# EAGLE design lightmeter_seeed2 (EAGLE 7.1.0)
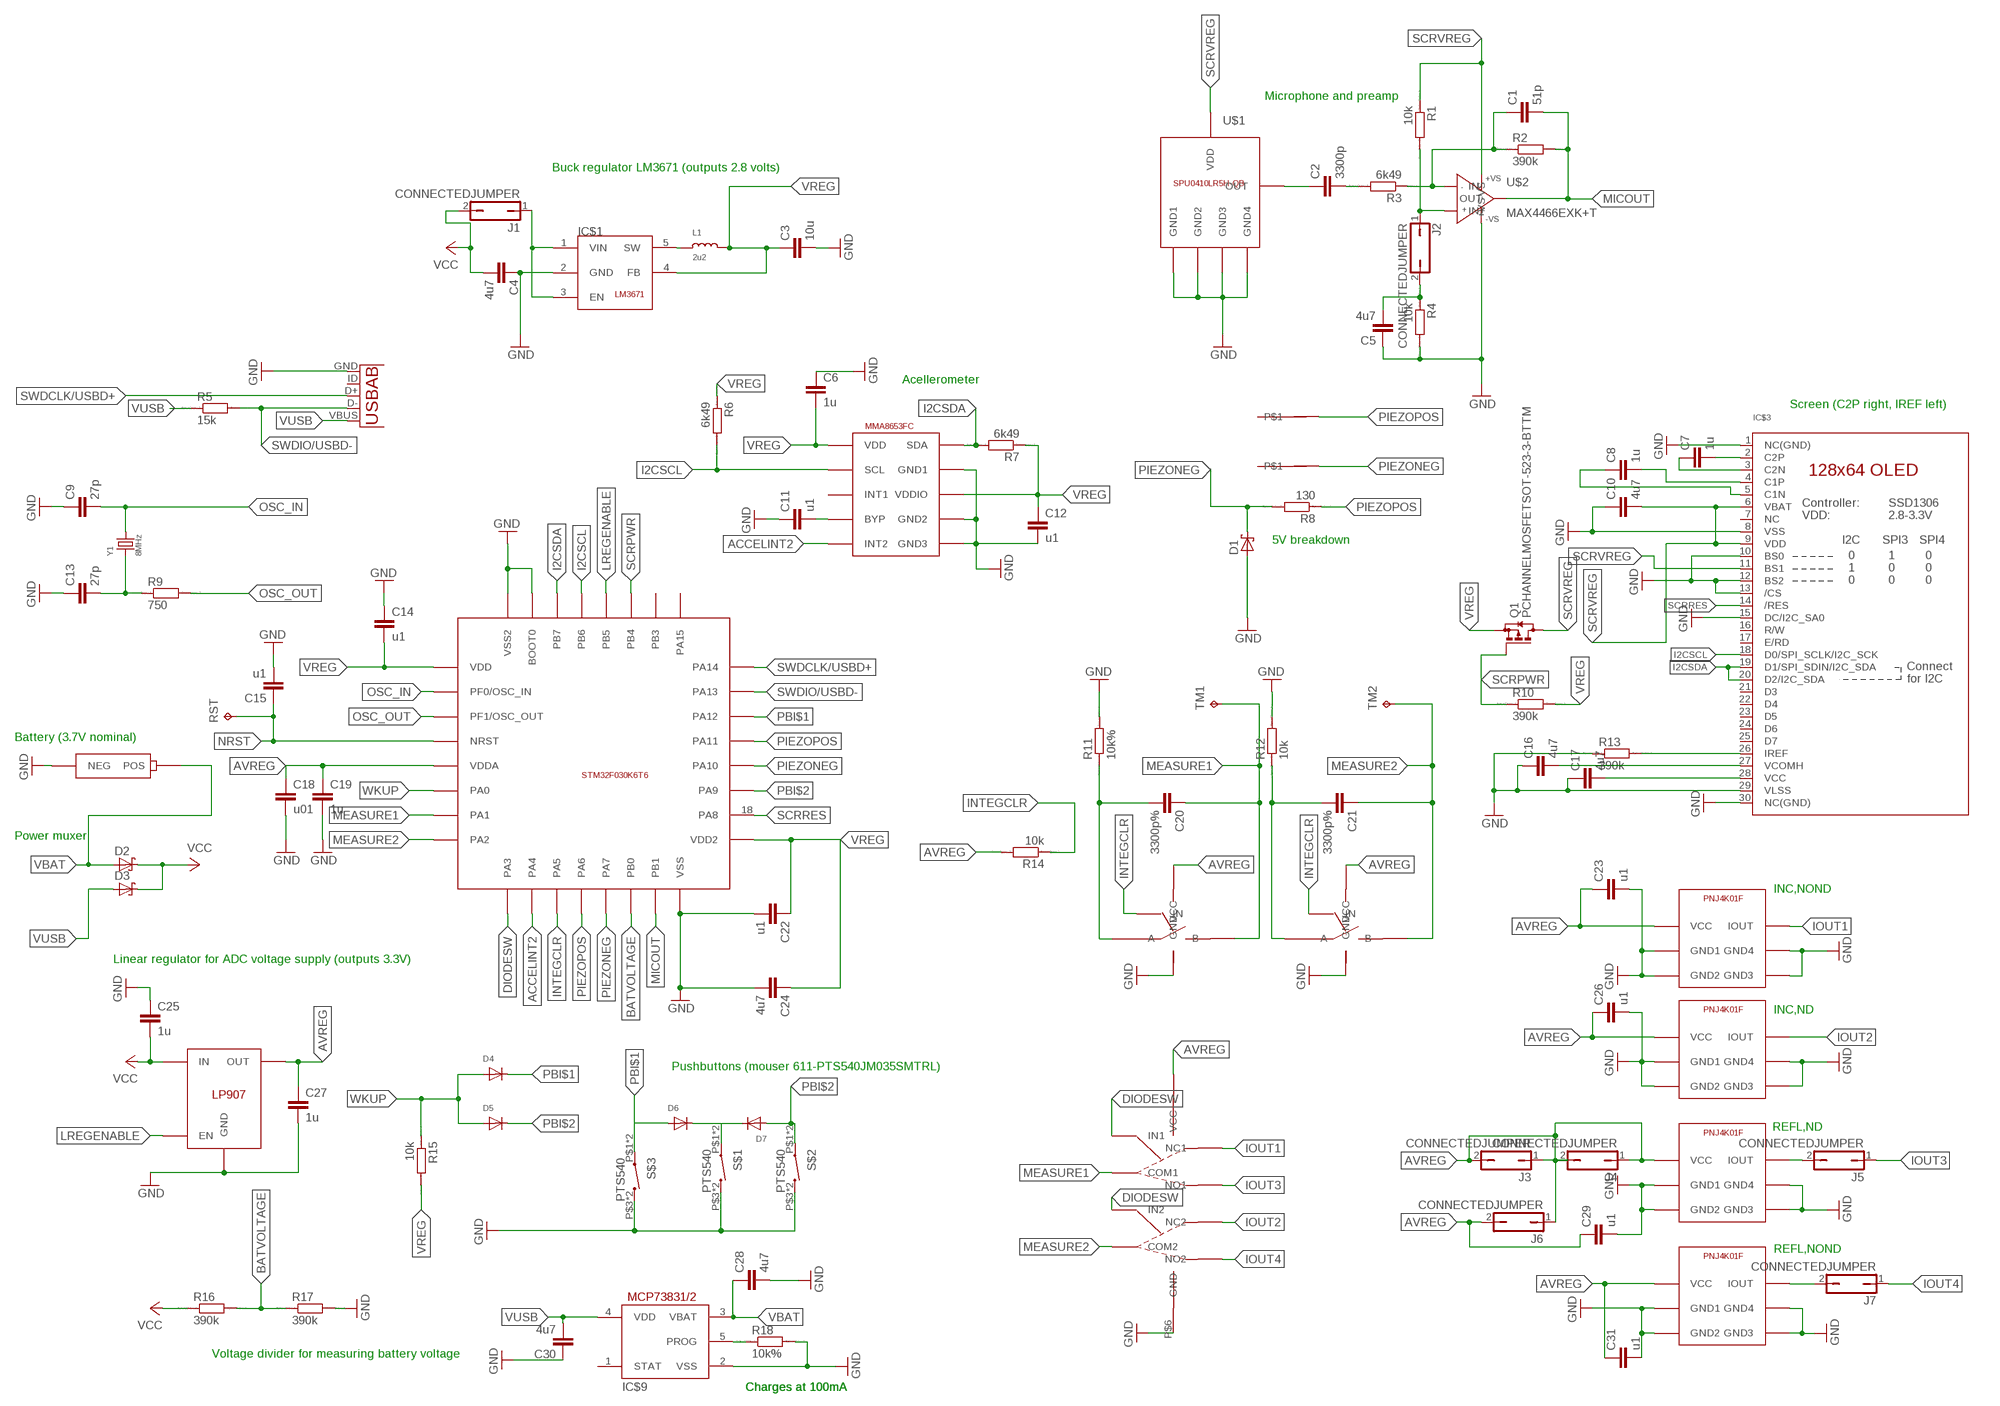
[diagram p0: schematic, sheet 1]

## Parts
C1  51p  C-EUC0402  [C0402]
C2  3300p  C-EUC0603  [C0603]
C3  10u  C-EUC0402  [C0402]
C4  4u7  C-EUC0402  [C0402]
C5  4u7  C-EUC0402  [C0402]
C6  1u  C-EUC0603  [C0603]
C7  1u  C-EUC0603  [C0603]
C8  1u  C-EUC0603  [C0603]
C9  27p  CGAP0402  [GAP0402]
C10  4u7  C-EUC0402  [C0402]
C11  u1  C-EUC0402  [C0402]
C12  u1  C-EUC0402  [C0402]
C13  27p  C-EUC0402  [C0402]
C14  u1  C-EUC0402  [C0402]
C15  u1  C-EUC0402  [C0402]
C16  4u7  C-EUC0402  [C0402]
C17  4u7  C-EUC0402  [C0402]
C18  u01  CGAP0402  [GAP0402]
C19  1u  C  [GAP0603]
C20  3300p%  C-EUC0603  [C0603]
C21  3300p%  C-EUC0603  [C0603]
C22  u1  C-EUC0402  [C0402]
C23  u1  C-EUC0402  [C0402]
C24  4u7  C-EUC0402  [C0402]
C25  1u  C-EUC0603  [C0603]
C26  u1  C-EUC0402  [C0402]
C27  1u  C-EUC0603  [C0603]
C28  4u7  C-EUC0402  [C0402]
C29  u1  C-EUC0402  [C0402]
C30  4u7  C-EUC0402  [C0402]
C31  u1  C-EUC0402  [C0402]
D1  SCHOTTKY-DIODESOD-923-BTTM  [SOD-923-BTTM]
D2  SCHOTTKY-DIODESC-79  [SC-79]
D3  SCHOTTKY-DIODESC-79  [SC-79]
D4  DIODESOD-323F  [SOD-323F]
D5  DIODESOD-323F  [SOD-323F]
D6  DIODESOD-323F  [SOD-323F]
D7  DIODESOD-323F  [SOD-323F]
IC$1  LM3671  [SOT23-5]
IC$2  MMA8653  [DFN-10]
IC$3  DISP_OLED_UG-2864HSWEG010.96"  [UG-2864HSWEG01_0.96IN_WRAPAROUND]
IC$4  STM32F030K6T6  [QFP-32]
IC$5  PNJ4K01F  [PNJ4K01F]
IC$6  LP5907  [SOT23-5L]
IC$7  PNJ4K01F  [PNJ4K01F]
IC$8  PNJ4K01F  [PNJ4K01F]
IC$9  MCP73831/OT  [SOT23-5L]
IC$10  PNJ4K01F  [PNJ4K01F]
J1  CONNECTEDJUMPER  [JUMPER_R0402]
J2  CONNECTEDJUMPER  [JUMPER_R0402]
J3  CONNECTEDJUMPER  [JUMPER_R0402]
J4  CONNECTEDJUMPER  [JUMPER_R0402]
J5  CONNECTEDJUMPER  [JUMPER_R0402]
J6  CONNECTEDJUMPER  [JUMPER_R0402]
J7  CONNECTEDJUMPER  [JUMPER_R0402]
L1  2u2  INDUCTOR_0603  [_0603]
Q1  PCHANNELMOSFETSOT-523-3-BTTM  [SOT-523-3-BTTM]
R1  10k  R-EU_R0402  [R0402]
R2  390k  R-EU_R0402  [R0402]
R3  6k49  R-EU_R0402  [R0402]
R4  10k  R-EU_R0402  [R0402]
R5  15k  R-EU_R0402  [R0402]
R6  6k49  R-EU_R0402  [R0402]
R7  6k49  R-EU_R0402  [R0402]
R8  130  R-EU_R0402  [R0402]
R9  750  R-EU_R0402  [R0402]
R10  390k  R-EU_R0402  [R0402]
R11  10k%  R-EU_R0402  [R0402]
R12  10k  R-EU_R0402  [R0402]
R13  390k  R-EU_R0402  [R0402]
R14  10k  R-EU_R0402  [R0402]
R15  10k  R-EU_R0402  [R0402]
R16  390k  RGAP  [JUMPER_R0402]
R17  390k  R-EU_R0402  [R0402]
R18  10k%  R-EU_R0402  [R0402]
RST  TPB1,27  [B1,27]
S$1  PTS540  [PTS540BTM]
S$2  PTS540  [PTS540BTM]
S$3  PTS540  [PTS540BTM]
TM1  TPB1,27  [B1,27]
TM2  TPB1,27  [B1,27]
U1  USB-ABUSB-AB-MICRO-MIDMOUNT  [USB-AB-MICRO-MIDMOUNT]
U$1  SPU0410LR5H-QBSPU0410LRSH-QB  [SPU0410LR5H-QB]
U$2  MAX4466EXK+T  [SC-70-5]
U$3  LIBAT  [78171-0002]
U$4  SN74LVC1G66  [SOT-553-5]
U$5  SN74LVC1G66  [SOT-553-5]
U$6  NLAS5223B  [WQFN10]
Y1  8MHz  CRYSTAL  [CRYSTAL3.2X5MM]
ZN  WIREATTACHMENT  [SMALLSQUAREWIREHOLE]
ZP  WIREATTACHMENT  [SMALLSQUAREWIREHOLE]

## Nets
ACCELINT2: IC$2.P$5(INT2) IC$4.10(PA4)
AVREG: C18.1 C19.1 C23.1 C26.1 C27.1 C29.1 C31.1 IC$4.5(VDDA) IC$5.P$1(VCC) IC$6.5(OUT) IC$7.P$1(VCC) IC$8.P$1(VCC) IC$10.P$1(VCC) J3.1 J3.2 J4.1 J4.2 J6.1 J6.2 R14.2 U$4.P$5(VCC) U$5.P$5(VCC) U$6.P$1(VCC)
BATVOLTAGE: IC$4.14(PB0) R16.2 R17.1
DIODESW: IC$4.9(PA3) U$6.P$4(IN1) U$6.P$8(IN2)
GND: C3.2 C4.1 C5.1 C6.1 C9.1 C10.1 C11.1 C12.2 C13.1 C14.1 C15.2 C16.1 C17.1 C18.2 C19.2 C22.2 C23.2 C24.2 C25.1 C26.2 C27.2 C28.2 C29.2 C30.1 C31.2 D1.P$1(A) IC$1.2(GND) IC$2.P$6(GND3) IC$2.P$7(GND2) IC$2.P$9(GND1) IC$3.1(NC(GND)) IC$3.8(VSS) IC$3.10(BS0) IC$3.12(BS2) IC$3.13(/CS) IC$3.15(DC/I2C_SA0) IC$3.29(VLSS) IC$3.30(NC(GND)) IC$4.16(VSS) IC$4.31(BOOT0) IC$4.32(VSS2) IC$5.P$2(GND1) IC$5.P$3(GND2) IC$5.P$4(GND3) IC$5.P$5(GND4) IC$6.2(GND) IC$7.P$2(GND1) IC$7.P$3(GND2) IC$7.P$4(GND3) IC$7.P$5(GND4) IC$8.P$2(GND1) IC$8.P$3(GND2) IC$8.P$4(GND3) IC$8.P$5(GND4) IC$9.2(VSS) IC$10.P$2(GND1) IC$10.P$3(GND2) IC$10.P$4(GND3) IC$10.P$5(GND4) R4.2 R11.2 R12.2 R13.1 R17.2 R18.2 S$1.P$3 S$1.P$4 S$2.P$3 S$2.P$4 S$3.P$3 S$3.P$4 U1.GND U$1.P$2(GND1) U$1.P$3(GND2) U$1.P$5(GND3) U$1.P$6(GND4) U$2.P$2(-VS) U$3.P$1(NEG) U$4.P$3(GND) U$5.P$3(GND) U$6.P$6(GND)
I2CSCL: IC$2.P$2(SCL) IC$3.18(D0/SPI_SCLK/I2C_SCK) IC$4.29(PB6) R6.2
I2CSDA: IC$2.P$10(SDA) IC$3.19(D1/SPI_SDIN/I2C_SDA) IC$3.20(D2/I2C_SDA) IC$4.30(PB7) R7.2
INTEGCLR: IC$4.11(PA5) R14.1 U$4.P$4(IN) U$5.P$4(IN)
IOUT1: IC$5.P$6(IOUT) U$6.P$5(NC1)
IOUT2: IC$7.P$6(IOUT) U$6.P$7(NC2)
IOUT3: J5.1 U$6.P$2(NO1)
IOUT4: J7.1 U$6.P$10(NO2)
LREGENABLE: IC$4.28(PB5) IC$6.3(EN)
MEASURE1: C20.1 IC$4.7(PA1) TM1.TP U$4.P$2(B) U$6.P$3(COM1)
MEASURE2: C21.1 IC$4.8(PA2) TM2.TP U$5.P$2(B) U$6.P$9(COM2)
MICOUT: C1.2 IC$4.15(PB1) R2.2 U$2.P$4(OUT)
N$1: IC$8.P$6(IOUT) J5.2
N$2: IC$10.P$6(IOUT) J7.2
N$3: C20.2 R11.1 U$4.P$1(A)
N$4: IC$1.1(VIN) IC$1.3(EN) J1.1
N$5: IC$9.5(PROG) R18.1
N$6: C21.2 R12.1 U$5.P$1(A)
N$7: C11.2 IC$2.P$4(BYP)
N$9: C13.2 R9.1 Y1.P$1
N$10: IC$1.5(SW) L1.1
N$12: C16.2 IC$3.27(VCOMH)
N$13: D6.C D7.C S$1.P$1 S$1.P$2
N$14: C2.1 U$1.P$1(OUT)
N$15: C7.2 IC$3.2(C2P)
N$16: C7.1 IC$3.3(C2N)
N$17: C2.2 R3.2
N$18: C1.1 R2.1 R3.1 U$2.P$3(IN-)
N$19: IC$3.26(IREF) R13.2
N$20: J2.1 R1.2 U$2.P$1(IN+)
N$21: C5.2 J2.2 R4.1
N$24: C8.1 IC$3.5(C1N)
N$27: C8.2 IC$3.4(C1P)
N$30: C17.2 IC$3.28(VCC)
NRST: C15.1 IC$4.4(NRST) RST.TP
OSC_IN: C9.2 IC$4.2(PF0/OSC_IN) Y1.P$2
OSC_OUT: IC$4.3(PF1/OSC_OUT) R9.2
PBI$1: D4.C D6.A IC$4.22(PA12) S$3.P$1 S$3.P$2
PBI$2: D5.C D7.A IC$4.19(PA9) S$2.P$1 S$2.P$2
PIEZONEG: D1.P$2(C) IC$4.13(PA7) IC$4.20(PA10) R8.2 ZN.P$1
PIEZOPOS: IC$4.12(PA6) IC$4.21(PA11) R8.1 ZP.P$1
SCRPWR: IC$4.27(PB4) Q1.P$2(G) R10.1
SCRRES: IC$3.14(/RES) IC$4.18(PA8)
SCRVREG: C10.2 IC$3.6(VBAT) IC$3.9(VDD) IC$3.11(BS1) Q1.P$1(D) R1.1 U$1.P$4(VDD) U$2.P$5(+VS)
SWDCLK/USBD+: IC$4.24(PA14) U1.D+
SWDIO/USBD-: IC$4.23(PA13) R5.2 U1.D-
VBAT: C28.1 D2.P$2(A) IC$9.3(VBAT) U$3.P$2(POS)
VCC: C4.2 C25.2 D2.P$1(C) D3.P$1(C) IC$6.1(IN) J1.2 R16.1
VREG: C3.1 C6.2 C12.1 C14.2 C22.1 C24.1 IC$1.4(FB) IC$2.P$1(VDD) IC$2.P$8(VDDIO) IC$4.1(VDD) IC$4.17(VDD2) L1.2 Q1.P$3(S) R6.1 R7.1 R10.2 R15.2
VUSB: C30.2 D3.P$2(A) IC$9.4(VDD) R5.1 U1.VBUS
WKUP: D4.A D5.A IC$4.6(PA0) R15.1
Unconnected: IC$2.P$3(INT1) IC$3.7(NC) IC$3.16(R/W) IC$3.17(E/RD) IC$3.21(D3) IC$3.22(D4) IC$3.23(D5) IC$3.24(D6) IC$3.25(D7) IC$4.25(PA15) IC$4.26(PB3) IC$9.1(STAT) U1.ID(USBID)

## Notes on the sheet
- Microphone and preamp
- Buck regulator LM3671 (outputs 2.8 volts)
- Acellerometer
- Screen (C2P right, IREF left)
- 5V breakdown
- Battery (3.7V nominal)
- Power muxer
- INC,NOND
- Linear regulator for ADC voltage supply (outputs 3.3V)
- INC,ND
- Pushbuttons (mouser 611-PTS540JM035SMTRL)
- REFL,ND
- REFL,NOND
- Voltage divider for measuring battery voltage
- Charges at 100mA | Charges at 100mA

## Library data of the parts
C1-C8 C10-C17 C20-C31 = rcl:C-EU: CAPACITOR, European symbol
C9 C18 C19 = lightmeter:C: CAPACITOR naming: grid - package width
D1-D3 = lightmeter:SCHOTTKY-DIODE: Schottky Diode
D4-D7 = adafruit:DIODE: Diode SMADIODE - SMA Surface Mount Package 20V 1A Schottky Diode Digikey: 641-1014-6-ND DO-1N4148 - Through Hole Small Current Diode SOD-123 20V 1 A (.5mV Vf) Schottky Diode - Digikey: MBRX120TPMSCT-ND SOD-323 10V 570mA (.38mV Vf, 3ns) Schottky Diode - Digikey: ZLLS410CT-ND SOD-523 30V 30mA Schottky Diode (RB751S-40TE61) - Digikey: RB751S-40TE61CT-ND SOT23-R/W - SOT23 Package (R = Solder Paste/Reflow Ovens, W = Hand-Soldering) BAT54Film 40V 300mA - Digikey: 497-7162-1-ND
IC$1 = lightmeter:LM3671
IC$2 = lightmeter:MMA8653
IC$3 = microbuilder:DISP_OLED_UG-2864HSWEG01: UG-2864HSWEG01 OLED display Both 1.3" and 0.96" models share the same FPC tab footprint, only the screen dimensions vary.
IC$4 = lightmeter:STM32F030K6T6
IC$5 IC$7 IC$8 IC$10 = lightmeter:PNJ4K01F
IC$6 = lightmeter:LP5907
IC$9 = adafruit:MCP73831: MCP73831/2 Miniature Single-Cell, Fully Integrated Li-Ion, Li-Polymer Charge Management Controllers. Nice and small simple lipoly charge controller, with adjustable current and status output (LED) http://www.ladyada.net/library/pcb/eaglelibrary.html
J1-J7 = lightmeter:CONNECTEDJUMPER
L1 = microbuilder:INDUCTOR: Inductors 0603: 10nH Ceramic Inductor - microwire antenna/RF (Digikey: 712-1434-2-ND) 0805: 560nH Ceramic Inductor - RF (Digikey: 553-1047-1-ND) 270nH Ceramic Inductor - Q = 40@250MHz, +-5%, 1 Ohm DC Resistance (Digikey: 535-10506-2-ND) 1007 (2518 Metric) SMT: 10µH 10% 250mOhm 820mA 1007 Inductor (Digikey: 587-2189-1-ND) 22µH 10% 500mOhm 580mA 1007 Inductor (Digikey: 587-2190-1-ND) 47µH 10% 950mOhm 420mA 1007 Inductor (Digikey: 587-2191-1-ND) 47µH 5% 100mOhm 1A 1008 Inductor (Digikey: 732-1816-1-ND) 5.0x5.0mm (Taiyo Yuden NR5040 Series) 6.8µH 20% 2.3A 64mOhm Inductor (Digikey: 587-2374-2-ND) 5.0x5.0mm (TDK VLC5045 Series) 4.7µH 20% 3.3A 34mOhm Inductor (Digikey: 445-6526-1-ND) 6.8µH 20% 2.7A 46mOhm Inductor (Digikey: 445-6527-1-ND) 6.0x6.0mm (TDK VLC6045 Series) 4.7µH 20% 3.8A 27mOhm Inductor (Digikey: 445-6538-2-ND) 6.8µH 20% 3A 41mOhm Inductor (Digikey: 445-6540-1-ND) 6.2µH 30% 2.2A 45mOhm Inductor (Digikey: SRR5028-6R2YCT-ND) - Not TDK VLC6045 but footprint should match 6.0x6.0mm (TDK SLF6045 Series) 6.8uH 30% 2A 33mOhm Inductor (Digikey: 445-4572-1-ND, Mouser: 810-SLF645T6R8N2R0PF)
Q1 = lightmeter:PCHANNELMOSFET
R1-R15 R17 R18 = resistor:R-EU_: RESISTOR, European symbol; SPICEPREFIX: R
R16 = lightmeter:RGAP
RST TM1 TM2 = testpad:TP: Test pad
S$1-S$3 = lightmeter:PTS540
U1 = lightmeter:USB-AB: This is a USB AB connector that is compatible with USB OTG. i.e. this connector can serve as a host or device
U$1 = lightmeter:SPU0410LR5H-QB
U$2 = lightmeter:MAX4466EXK+T
U$3 = lightmeter:LIBAT
U$4 U$5 = lightmeter:SN74LVC1G66
U$6 = lightmeter:NLAS5223B
Y1 = lightmeter:CRYSTAL
ZN ZP = lightmeter:WIREATTACHMENT

## Board
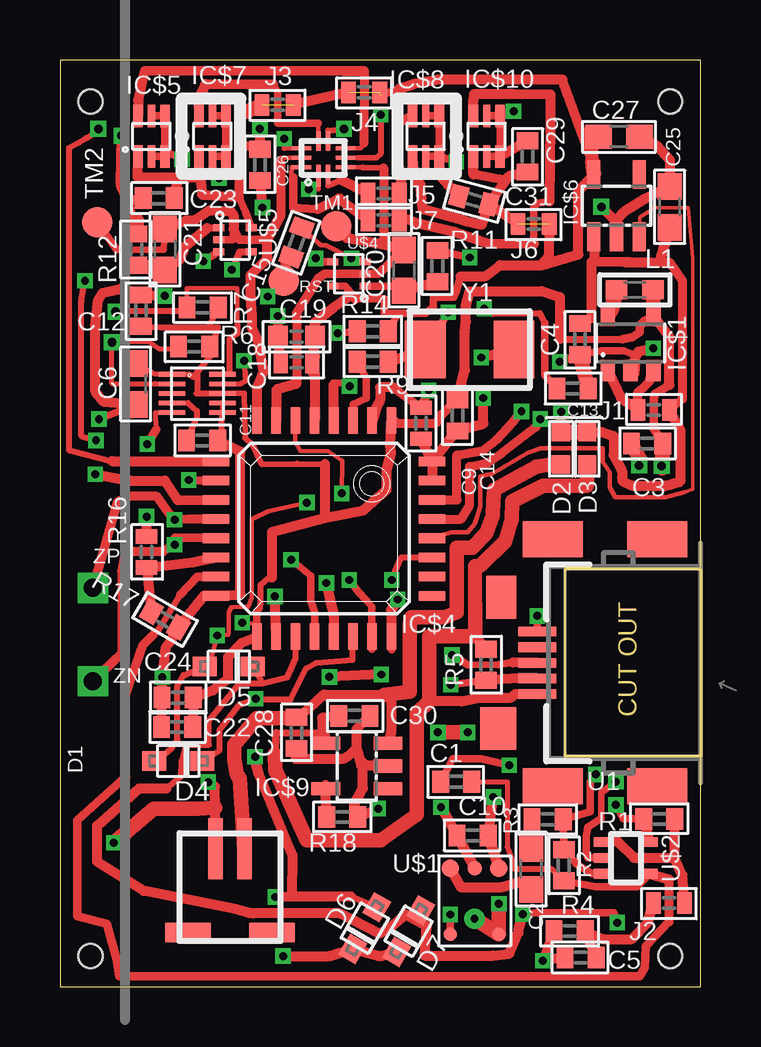
[diagram p1: board, top side]
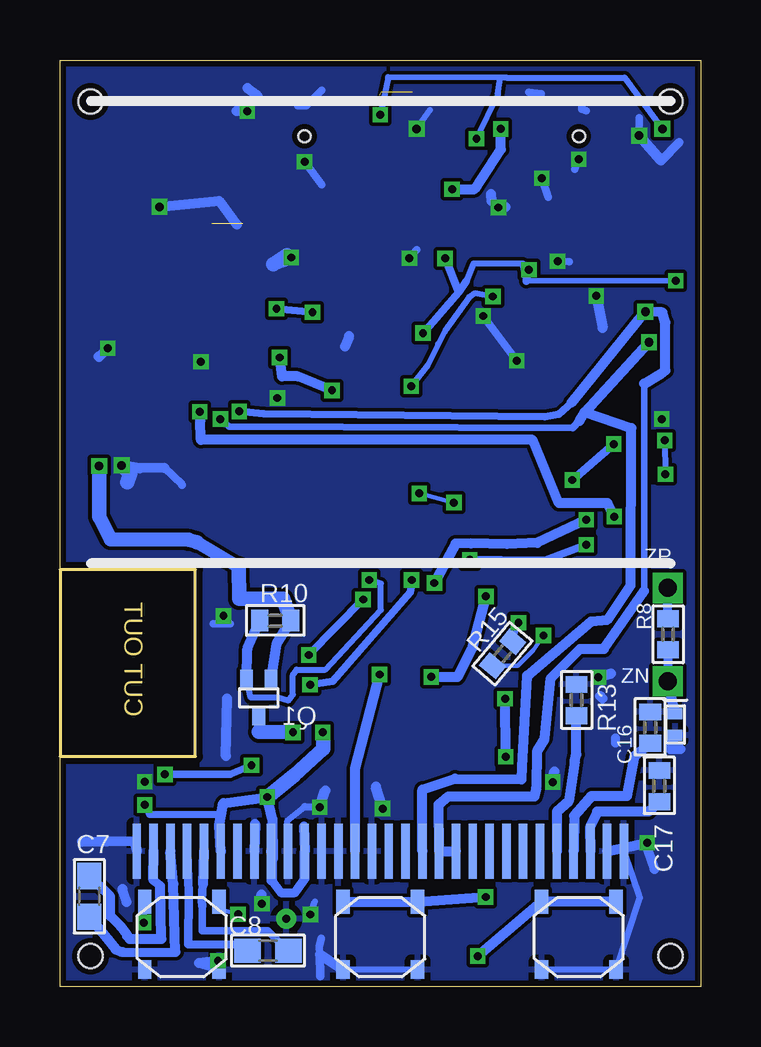
[diagram p2: board, bottom side, seen from below]

Size 26.7 x 38.61 mm. Coordinates in mm from the lower left corner, seen from the top.
Outline: 0,0 26.7,0 26.7,38.61 0,38.61 0,0
Copper layers (1*16): Top 0.035mm / dielectric 1.5mm / Bottom 0.035mm
Design rules "SeeedStudio_2layer_DRU_no_angle_20140221": minimum track width 6mil, minimum drill 12mil, track to track 6mil, track to pad 6mil, pad to pad 6mil, via to via 6mil, smd to smd 0mil, copper to edge 10mil, drill to drill 10mil, minimum pad ring 10mil, minimum via ring 6mil, stop-mask expansion 2mil, vias tented up to drill 100mil, thermal gap 10mil
Holes 1 mm at 25.43,36.88 25.43,1.27 1.27,1.27 1.27,36.88
Holes 0.5 mm at 5.08,35.43 16.51,35.43

### Footprints (pad centres in the part's own frame; a part is rotated, then mirrored left to right if it is on the bottom)
C0402 = smd 0.7 x 0.9: 1 -0.65,0; 2 0.65,0
C0603 = smd 1.1 x 1: 1 -0.85,0; 2 0.85,0
GAP0402 = smd 0.584 x 0.9: 1 -0.65,0; 2 0.65,0
GAP0603 = smd 0.819 x 0.9: 1 -0.767,0; 2 0.767,0
SOD-923-BTTM = smd 0.45 x 0.6 bottom: P$1 -0.45,0; P$2 0.45,0
SC-79 = smd 0.762 x 0.762: P$1 -0.675,0; P$2 0.675,0
SOD-323F = smd 1 x 0.8: A -1,0; C 1,0
SOT23-5 = smd 0.6 x 0.9: 1 -0.95,-1.15; 2 0,-1.15; 3 0.95,-1.15; 4 0.95,1.15; 5 -0.95,1.15
DFN-10 = smd 0.191 x 1.099: P$1 -0.8,-1.048; P$2 -0.4,-1.048; P$3 0,-1.048; P$4 0.4,-1.048; P$5 0.8,-1.048; P$6 0.8,1.048; P$7 0.4,1.048; P$8 0,1.048; P$9 -0.4,1.048; P$10 -0.8,1.048
UG-2864HSWEG01_0.96IN_WRAPAROUND = smd 0.35 x 2.286 bottom: 1 -10.15,-1.2; 2 -9.45,-1.2; 3 -8.75,-1.2; 4 -8.05,-1.2; 5 -7.35,-1.2; 6 -6.65,-1.2; 7 -5.95,-1.2; 8 -5.25,-1.2; 9 -4.55,-1.2; 10 -3.85,-1.2; 11 -3.15,-1.2; 12 -2.45,-1.2; 13 -1.75,-1.2; 14 -1.05,-1.2; 15 -0.35,-1.2; 16 0.35,-1.2; 17 1.05,-1.2; 18 1.75,-1.2; 19 2.45,-1.2; 20 3.15,-1.2; 21 3.85,-1.2; 22 4.55,-1.2; 23 5.25,-1.2; 24 5.95,-1.2; 25 6.65,-1.2; 26 7.35,-1.2; 27 8.05,-1.2; 28 8.75,-1.2; 29 9.45,-1.2; 30 10.15,-1.2
QFP-32 = smd 0.4 x 1.1: 1 -2.4,-4.1; 2 -1.6,-4.1; 3 -0.8,-4.1; 4 0,-4.1; 5 0.8,-4.1; 6 1.6,-4.1; 7 2.4,-4.1; 8 3.2,-4.1; 17 3.2,4.9; 18 2.4,4.9; 19 1.6,4.9; 20 0.8,4.9; 21 0,4.9; 22 -0.8,4.9; 23 -1.6,4.9; 24 -2.4,4.9 | smd 1.1 x 0.4: 9 4.9,-2.4; 10 4.9,-1.6; 11 4.9,-0.8; 12 4.9,0; 13 4.9,0.8; 14 4.9,1.6; 15 4.9,2.4; 16 4.9,3.2; 25 -4.1,3.2; 26 -4.1,2.4; 27 -4.1,1.6; 28 -4.1,0.8; 29 -4.1,0; 30 -4.1,-0.8; 31 -4.1,-1.6; 32 -4.1,-2.4
PNJ4K01F = smd 0.925 x 0.401: P$1 -0.843,0.56; P$3 -0.843,-0.56; P$4 0.843,-0.56; P$6 0.843,0.56 | smd 0.925 x 0.3: P$2 -0.843,0; P$5 0.843,0
SOT23-5L = smd 0.55 x 1.2: 1 -0.95,-1.3; 2 0,-1.3; 3 0.95,-1.3; 4 0.95,1.3; 5 -0.95,1.3
JUMPER_R0402 = smd 0.61 x 0.9: 1 -0.65,0; 2 0.65,0
_0603 = smd 0.9 x 0.8: 1 -0.762,0; 2 0.762,0
SOT-523-3-BTTM = smd 0.533 x 0.762 bottom: P$1 0,0.775; P$2 -0.511,-0.775; P$3 0.511,-0.775
R0402 = smd 0.7 x 0.9: 1 -0.65,0; 2 0.65,0
B1,27 = smd 1.27 x 1.27: TP 0,0
PTS540BTM = smd 0.559 x 1.016 bottom: P$1 -1.55,1.477; P$2 1.55,1.477 | smd 0.559 x 0.762 bottom: P$3 -1.55,-1.35; P$4 1.55,-1.35
USB-AB-MICRO-MIDMOUNT = smd 1.579 x 0.4: D+ 3.378,0; D- 3.378,0.65; GND 3.378,-1.3; ID 3.378,-0.65; VBUS 3.378,1.3 | smd 2.5 x 1.5: P$1 -1.625,-5.15; P$2 -1.625,5.15; P$6 2.725,5.15; P$7 2.725,-5.15 | smd 1.5 x 1.778: P$3 5.01,2.733 | smd 1.246 x 1.778: P$4 4.883,-2.733
SPU0410LR5H-QB = smd 0.723 x 0.723: P$1 -1.015,2.103; P$4 1.015,2.103 | smd 0.562 x 0.562: P$2 -1.015,-0.634; P$3 1.015,-0.634 | smd 0.612 x 0.612: P$5 0,2.103 | drill 0.33: P$6 0,0
SC-70-5 = smd 0.711 x 0.406: P$1 -0.978,0.66; P$2 -0.978,0; P$3 -0.978,-0.66; P$4 0.978,-0.66; P$5 0.978,0.66
78171-0002 = smd 0.6 x 2.54: P$1 -0.6,1.61; P$2 0.6,1.61 | smd 1.905 x 0.8: P$300 -1.75,-1.887; P$400 1.75,-1.887
SOT-553-5 = smd 0.45 x 0.279: P$1 -0.675,0.5; P$2 -0.675,0; P$3 -0.675,-0.5; P$4 0.675,-0.5; P$5 0.675,0.5
WQFN10 = smd 0.917 x 0.178: P$1 -0.747,0.199 | smd 0.815 x 0.178: P$2 -0.696,-0.199; P$6 0.696,-0.199; P$7 0.696,0.199 | smd 0.178 x 0.815: P$3 -0.399,-0.914; P$4 0,-0.914; P$5 0.399,-0.914 | smd 0.178 x 0.805: P$8 0.399,0.914; P$9 0,0.914; P$10 -0.399,0.914
CRYSTAL3.2X5MM = smd 1.7 x 2.4: P$1 -1.85,0; P$2 1.85,0
SMALLSQUAREWIREHOLE = drill 0.75 pad 1.125 square: P$1 0,0

### Placement (x,y rotation side)
C1  16.51,8.53 0 top
C2  19.63,4.9 90 top
C3  24.46,22.63 180 top
C4  21.67,26.97 90 top
C5  21.69,1.21 0 top
C6  3.15,25.11 90 top
C7  25.48,3.76 90 bottom
C8  18.03,1.5 180 bottom
C9  15.04,23.47 90 top
C10  17.2,6.3 0 top
C11  5.92,22.76 180 top
C12  3.38,28.17 90 top
C13  21.36,24.92 180 top
C14  16.56,23.8 90 top
C15  9.86,31.01 70 top
C16  2.11,10.79 270 bottom
C17  1.73,8.36 270 bottom
C18  9.86,26.01 180 top
C19  9.86,27.08 180 top
C20  14.33,29.85 270 top
C21  4.37,30.72 270 top
C22  4.88,10.82 180 top
C23  4.11,32.85 180 top
C24  4.9,12.04 180 top
C25  25.4,32.49 270 top
C26  8.33,34.24 270 top
C27  23.29,35.41 0 top
C28  9.86,10.57 270 top
C29  19.48,34.59 90 top
C30  12.27,11.28 180 top
C31  17.25,32.77 165 top
D1  1.07,10.92 90 top
D2  20.88,22.43 270 top
D3  21.97,22.43 270 top
D4  4.93,9.4 0 top
D5  7.04,13.33 0 top
D6  12.7,2.44 240 top
D7  14.53,2.31 240 top
IC$1  23.77,26.82 0 top
IC$2  5.71,24.71 270 top
IC$3  13.35,4.44 180 top
IC$4  11.4,19.48 180 top
IC$5  3.81,35.43 90 top
IC$6  23.19,32.54 0 top
IC$7  6.35,35.43 90 top
IC$8  15.24,35.43 90 top
IC$9  12.37,9.19 90 top
IC$10  17.78,35.43 90 top
J1  24.74,24.03 0 top
J2  25.37,3.48 180 top
J3  9.07,36.74 180 top
J4  12.67,37.26 180 top
J5  13.49,33.05 0 top
J6  19.74,31.78 180 top
J7  13.49,31.93 0 top
L1  23.95,29.03 0 top
Q1  18.41,12.04 180 top
R1  24.97,6.98 0 top
R2  20.99,5.05 270 top
R3  20.32,6.97 180 top
R4  21.23,2.31 180 top
R5  17.75,13.41 270 top
R6  5.59,26.67 180 top
R7  5.94,28.3 180 top
R8  1.37,14.68 270 bottom
R9  13.03,26.04 180 top
R10  17.73,15.25 0 bottom
R11  15.72,30.02 90 top
R12  3.18,30.71 90 top
R13  5.18,11.94 270 bottom
R14  13.03,27.31 0 top
R15  8.26,13.87 50 bottom
R16  3.61,18.11 270 top
R17  4.37,15.29 330 top
R18  11.76,7.06 0 top
RST  9.32,29.41 0 top
S$1  5.08,2.06 0 top
S$2  21.62,2.06 0 top
S$3  13.35,2.06 0 top
TM1  11.51,31.67 0 top
TM2  1.55,31.85 0 top
U1  23.27,13.49 180 top
U$1  17.27,2.82 0 top
U$2  23.57,5.36 0 top
U$3  7.09,4.14 0 top
U$4  12.04,29.69 180 top
U$5  7.29,31.12 0 top
U$6  10.97,34.53 90 top
Y1  17.07,26.54 0 top
ZN  1.37,12.73 0 top
ZP  1.37,16.61 0 top

### Tracks (layer width: path | path; a pad name or v marks a point on that pad's centre or on a via)
ACCELINT2  (via drill 0.33)
  Top 0.203: 4.01,23.22 3.99,23.93 IC$2.P$5
  Top 0.356: IC$4.10 v5.36,21.11 | v3.63,22.61 4.01,23.22
  Bottom 0.356: v5.36,21.11 v3.63,22.61
AVREG  (via drill 0.33)  (4 unrouted)
  Top 0.178: U$6.P$1 10.77,33.22
  Top 0.203: 10.77,33.22 v10.36,33.22
  Top 0.305: 5.84,33.71 5.92,33 | 13.39,37.13 14.17,37.44 | 14.1,28.05 13.51,28.07 13.51,28.65 12.32,28.65 11.89,29.19 U$4.P$5 | 14.1,28.05 15.24,28.05 15.55,28.33 15.55,28.63 15.57,28.71 16.41,28.71 16.48,28.91 16.69,29.59 | U$5.P$5 7.75,32.26 7.46,32.91 | R14.2 14.1,28.05
  Top 0.381: 7.46,35.1 7.46,35.91 7.6,36.4 | 7.46,35.1 7.46,32.91 | C26.1 7.46,35.1 | 18.52,33.59 17.22,33.84
  Top 0.406: C27.1 22.24,35.21 IC$6.5 21.6,33.15 21.6,30.51 21.03,30.34 20.06,30.06 | 4.93,33.73 3.4,33.73 3.23,33.72 IC$5.P$1 | 4.93,33.73 5.84,33.71 | 14.17,37.44 14.71,37.59 15.77,37.8 20.93,37.8 22.19,34.39 22.1,34.1 | IC$4.5 10.62,24.14 10.62,25.5 10.53,25.59 C18.1 | 10.62,26.26 10.53,26.4 C18.1 | 16.69,29.59 17.73,29.6 18.34,30.06 20.06,30.06 | J4.2 J3.1 | 12.32,28.65 12.12,28.8 11.41,28.3 10.62,27.69 C19.1 C18.1 | 7.46,32.91 5.92,33 5.79,34.16 IC$7.P$1 | C23.1 4.93,33.73 | IC$8.P$1 14.69,34.23 14.91,33.45 15.01,33.43 15.11,32.38 16.87,31.9 17.58,31.75 C31.1 | C29.1 18.7,33.76 | 18.7,33.76 18.52,33.59 | 17.22,33.84 17.22,34.16 IC$10.P$1 | C31.1 J6.2 | C31.1 18.7,33.76 | J6.1 20.37,30.4 20.06,30.06 | v8.33,35.74 C26.1
  Top 0.559: 8.31,36.68 J3.2
  Top 0.61: IC$6.5 22.19,34.39 | 8.31,36.68 7.6,36.4
  Bottom 0.406: v8.33,35.74 C26.1 9.42,33.22 v10.36,33.22
BATVOLTAGE
  Top 0.406: IC$4.14 5.51,17.68 R16.2 R17.1
DIODESW  (via drill 0.33, 0.36)
  Top 0.178: 12.41,34.53 U$6.P$4 | U$6.P$8 9.35,34.93
  Top 0.229: 13.18,34.54 12.41,34.53 | 9.35,34.93 v9.35,35.33
  Top 0.254: 13.18,34.54 13.36,34.7 v13.36,36.32 | v1.6,35.74 1.55,35.64 1.09,35.36 0.76,35.15 0.38,34.95 0.38,22.35 2.16,21.9
  Top 0.406: 2.16,21.9 IC$4.9
  Bottom 0.254: v1.6,35.74 3.18,37.87 8.1,37.87 8.35,37.87 | v9.35,35.33 8.46,37.16 8.35,37.87 | 8.35,37.87 13.03,37.9 v13.36,36.32
GND  (via drill 0.33, 0.36)
  Top 0.178: U$6.P$6 11.18,35.66 | C15.2 10.87,30.9 11.07,30.9 v12.14,30.35
  Top 0.203: IC$2.P$9 7.53,25.11 | IC$2.P$7 IC$2.P$6
  Top 0.229: 7.53,25.11 7.73,25.25 v7.67,26.07
  Top 0.254: C6.1 3,23.8 | C11.1 6.75,23.21 IC$2.P$6 6.75,23.67 | 11.18,35.66 v11.84,35.74
  Top 0.279: 22.55,7.01 22.55,8.08 v23.16,8.53
  Top 0.305: 2.59,35.43 v2.56,35.46 | R11.2 v17.07,30.38 | U$1.P$2 v16.27,3 | C6.1 v1.63,23.65 | U1.GND v19.89,15.44 | IC$5.P$5 IC$5.P$4 IC$5.P$3 | IC$5.P$3 IC$5.P$2 | IC$5.P$3 4.32,34.85 v5.08,34.47 | IC$7.P$2 IC$7.P$3 | v6.63,33.68 6.35,33.86 IC$7.P$2 | IC$8.P$5 IC$8.P$4 IC$8.P$3 | IC$8.P$2 IC$8.P$3 | IC$8.P$3 v16.51,34.37 | IC$10.P$2 IC$10.P$3 IC$10.P$4 IC$10.P$5 | 24,26.29 23.5,26.49 22.58,26.49 C4.1 v20.83,26.04 | U$5.P$3 v5.97,30.23 | U$4.P$3 v12.14,30.35 | IC$7.P$5 IC$7.P$4 IC$7.P$3 IC$7.P$2 | U$2.P$2 22,5.36 21.92,5.61 21.92,6.27 22,6.63 22.55,7.01
  Top 0.356: 24,26.06 23.98,25.55 IC$1.2
  Top 0.406: IC$4.32 IC$4.31 | C27.2 24.84,35.05 25.43,34.42 C25.1 24.98,33.14 24.38,32.82 23.52,32.28 23.22,31.98 23.22,31.26 IC$6.2 23.19,31.85 v22.55,32.49 | 12.55,9.22 12.62,9.35 12.62,8.25 12.26,7.61 R18.2 v13.26,7.42 | 12.55,9.22 13.39,9.22 IC$9.2 | C30.1 12.94,11.32 12.34,10.72 12.34,9.93 | 12.34,9.93 12.55,9.22 | C28.2 9.82,9.48 11.81,9.5 12.04,9.63 12.34,9.93 | IC$4.32 16.28,22.87 C14.1 17.64,23.46 v17.64,24.52 | IC$1.2 24,26.29 24.11,26.47 v24.71,26.59 | v4.36,28.78 C12.2 2.54,29.08 1.78,28.91 1.6,28.63 1.47,27.51 1.47,24.79 1.82,24.37 C6.1 | C22.2 C24.2 v4.27,12.89 4.39,14.1 4.55,14.33 4.92,14.98 R17.2 5.98,16.28 IC$4.16 7.52,16.31 7.52,22.3 C11.1 | v2.56,35.46 2.54,33.45 2.59,33.25 2.79,32.74 | U$3.P$1 6.47,7.45 6.45,8.33 v6.17,8.52 | R12.2 2.79,32.74 | 2.79,32.74 C23.2 | C26.2 v8.43,32.46 | IC$8.P$3 15.8,33.83 C31.2 | v9.07,27.94 C19.2 C18.2 | C29.2 IC$10.P$3 | IC$10.P$4 v18.9,36.47 | R4.2 v20.12,1.08 C5.1 | C10.1 U$1.P$5 16.48,6.4 v15.88,7.47 | IC$4.32 C9.1
  Top 0.61: C3.2 24.17,22 v24.13,21.72 | R12.2 3.2,31.93 | v18.29,3.45 U$1.P$3 U$1.P$6 | v2.23,5.99 3.91,7.42 5.74,7.42 6.47,7.45 | C13.1 C4.1
  Bottom 0.254: v11.84,35.74 11.28,36.52 | S$3.P$3 S$3.P$4 | S$1.P$4 S$1.P$3 2.54,3.68 IC$3.30 | v16.27,3 16.08,3.54 | IC$3.10 17.22,6.91 16.51,7.49
  Bottom 0.305: v7.67,26.07 v9.07,27.94 | 15.8,37.34 16.43,36.7 16.79,36.7 | 4.98,36.93 4.95,36.55 4.78,36.5 | 18.57,5.3 IC$3.8 | v2.56,35.46 2.56,36.2 | 15.88,1.35 15.89,1.66 15.82,2.01 | v15.88,7.47 16.51,7.49 | v1.63,23.65 1.5,23.7 | v19.89,15.44 19.61,15.11 20.32,15.11 | v5.08,34.47 5.26,34.06 | v6.63,33.68 6.35,32.89 | 6.65,37.21 7.16,37.26 | v16.51,34.37 15.8,33.4 | v5.97,30.23 5.49,30.2 | v12.14,30.35 11.84,30.71 | v23.16,8.53 23.27,8.38 | v20.83,26.04 20.75,26.19
  Bottom 0.343: 21.62,20.9 22.35,21.62
  Bottom 0.356: 15.85,0.43 15.88,1.35 | 0.89,35.18 1.65,34.42 | 4.2,12.12 4.15,12.12 | S$2.P$3 20.91,0.98
  Bottom 0.381: 3.56,10.36 3.56,10.16 | D1.P$1 1.27,9.91
  Bottom 0.406: 4.09,12 4.2,12.12 | v22.55,32.49 20.07,32.74 19.33,31.75 | v24.71,26.59 25.07,26.24 25.09,26.26 | S$3.P$4 15.88,1.35 | 18.57,6.78 IC$3.8 | v13.26,7.42 13.54,8.33 | 25.78,6.04 23.6,6.07 IC$3.1 | 19.79,9.6 19.74,12.01 | 1.65,34.42 v2.56,35.46 | 2.34,6.04 1.93,4.9 | 1.27,9.91 0.84,9.91 | v4.36,28.78 4.09,27.43 | v4.27,12.89 3.73,13.06 | 22.35,21.62 23.39,21.59 v24.13,21.72 | 8.71,32.74 8.74,33.02 | v6.17,8.52 6.1,8.97 | 18.47,37.11 18.9,37.44 | v8.43,32.46 8.13,32.49 | IC$3.29 v2.23,5.99 | v18.9,36.47 19.36,36.47 | 23.93,3.53 24.11,4.06 | v20.12,1.08 20.91,0.98 | v15.88,7.47 15.65,8.18 | v18.29,3.45 18.31,3.83 | 14.66,27.1 14.83,26.67
  Bottom 0.61: v24.13,21.72 23.77,21.36 23.9,21.01 | 17.22,30.48 17.67,30.19 | 17.67,30.19 17.8,30.1 | v17.07,30.38 17.67,30.19
  pour Bottom: -0.03,38.89 26.62,39.04 26.42,0.23 -0.23,0.08
I2CSCL  (via drill 0.33, 0.36)
  Top 0.178: 5.01,26.58 arc-90 5.19,26.4
  Top 0.203: IC$2.P$2 3.96,25.12 2.16,25.12 v2.16,26.85 3.61,26.87 3.78,26.82 4.12,26.58 5.01,26.58
  Top 0.229: 5.19,26.4 R6.2
  Top 0.381: IC$4.29 16.71,19.48 17.07,20.07 17.07,21.67 17.83,21.82 18.41,22.23 19.84,23.32 v20.02,23.65
  Bottom 0.292: v20.02,23.65 19.66,23.34 5.33,23.29
  Bottom 0.305: 5.33,23.29 5.05,23.57
  Bottom 0.406: 5.05,23.57 4.84,23.94 | 4.84,23.94 v2.16,26.85 | IC$3.18 11.6,8.21 10.24,8.66 7.47,8.64 7.44,9.17 7.24,12.95 4.57,15.21 3.89,15.29 2.92,16.71 2.9,23.27 4.84,23.94
I2CSDA  (via drill 0.33, 0.36)
  Top 0.178: R7.2 5.28,29.1 7.39,29.1 7.39,27.56
  Top 0.229: 7.06,25.53 IC$2.P$10
  Top 0.254: 7.39,27.56 7.39,27.2 7.06,26.98 7.06,25.53 | 2.36,28.17 5.04,28.17 R7.2
  Top 0.305: v2.31,28.12 2.34,28.17 2.36,28.17
  Top 0.381: IC$4.30 16.54,20.28 16.54,22.15 17.6,22.33 18.21,22.81 18.87,23.52 v19.23,23.96
  Bottom 0.279: 2.36,16.49 2.36,25.12
  Bottom 0.305: v19.23,23.96 18.21,23.88 6.5,23.75 5.92,23.85 5.38,24.33
  Bottom 0.406: 5.38,24.33 v2.31,28.12 1.6,28.09 1.47,27.66 1.47,25.68 1.68,25.53 2.36,25.12 | IC$3.20 IC$3.19 10.93,7.59 10.52,7.92 6.93,7.92 6.86,8.28 6.84,9.8 6.5,10.34 6.25,12.85 5.03,14.07 4.04,14.07 2.36,16.49
INTEGCLR  (via drill 0.33)
  Top 0.254: v1.5,22.76 0.89,22.94 0.89,28.55 v1.04,29.41
  Top 0.305: U$5.P$4 7.49,30.61 v7.16,29.87 | U$4.P$4 11,30.2 v10.66,30.34 | v11.58,27.23 R14.1
  Top 0.406: v1.47,21.35 2.92,21.08 4.37,21.08 4.9,20.27 IC$4.11
  Bottom 0.254: v1.04,29.41 7.26,29.4 7.42,30.12 9.47,30.12 9.78,29.39 | v1.5,22.76 v1.47,21.35
  Bottom 0.305: v11.58,27.23 10.09,28.93 | 10.09,28.93 9.78,29.39 | v7.16,29.87 7.26,29.4 | v10.66,30.34 10.09,28.93
IOUT1
  Top 0.178: U$6.P$5 12.52,34.93
  Top 0.203: 12.52,34.93 12.68,35.15
  Top 0.254: 12.68,36.63 12.65,35.95
  Top 0.381: 12.68,38.15 12.68,36.63 12.68,35.15
  Top 0.394: 3.25,36.93 3.53,38.16 11.2,38.16 11.81,38.15
  Top 0.406: 11.81,38.15 12.68,38.15 | 3.25,36.93 IC$5.P$6
IOUT2
  Top 0.178: 10.77,35.98 10.77,35.69 U$6.P$7
  Top 0.305: 8.89,37.6 9.07,37.26 9.07,35.98 10.77,35.98
  Top 0.394: 8.89,37.6 6.07,37.6
  Top 0.406: 6.07,37.6 5.87,37.21 5.77,36.96 IC$7.P$6
IOUT3
  Top 0.203: 11.18,33.38 U$6.P$2
  Top 0.254: 11.74,33.6 11.18,33.38 | 12.71,33.1 J5.1
  Top 0.406: 12.71,33.1 11.74,33.6
IOUT4
  Top 0.178: 9.72,33.73 9.63,33.83 9.65,34.13 U$6.P$10
  Top 0.356: 9.72,33.73 9.72,32.45 10.72,32.4
  Top 0.406: 10.72,32.4 11.66,32.84 11.61,32.83 J7.1
LREGENABLE
  Top 0.152: 26.01,20.6 26.37,20.73 26.37,30.35 26.19,32.46 24.79,32.46 24.16,32.05 IC$6.3
  Top 0.178: 26.01,20.6 25.25,20.4 23.14,20.4 22.91,20.8 22.91,21.44 22.61,21.87 22.61,22.43 20.04,22.43 19.48,22.25 18.01,21.36 17.5,21.26 17.5,19.99 17.27,19.28 16.99,18.92 16.31,18.92 IC$4.28
MEASURE1
  Top 0.178: U$6.P$3 12.6,34.13
  Top 0.254: 12.6,34.13 13.49,34.11
  Top 0.356: C20.1 13.28,29.69 U$4.P$2 11.02,29.69 10.77,29.52
  Top 0.368: 9.86,28.07 9.86,27.81
  Top 0.381: 13.49,34.11 13.49,31.52 13.48,30.91 | 9.86,27.81 9.86,25.12 | 10.77,29.52 9.86,28.07
  Top 0.406: C20.1 13.48,30.91 11.95,31.19 11.86,31.57 TM1.TP | 9.86,25.12 9.02,24.87 IC$4.7
MEASURE2
  Top 0.178: 9.26,34.53 9.2,34.34 | 9.2,34.53 9.26,34.53 | U$6.P$9 9.26,34.53
  Top 0.279: 2.36,30.71 4.32,30.71 C21.1
  Top 0.305: TM2.TP 2.36,30.71 | 7.24,31.57 7.19,31.12 U$5.P$2
  Top 0.356: 7.24,31.57 7.47,31.12 8.64,31.12
  Top 0.381: 9.2,34.34 9.2,32.14
  Top 0.406: C21.1 5.26,31.92 5.61,31.94 6.22,32.35 7.09,32.31 7.24,32.13 7.24,31.57 | IC$4.8 8.2,24.94 8.48,25.65 8.28,26.82 8,27.46 8,27.94 7.95,28.7 7.95,29.67 8.64,30.33 8.64,31.12 9.2,32.14
MICOUT
  Top 0.203: C1.2 18.64,8.53 18.63,5.82 18.96,4.9
  Top 0.254: 18.96,4.9 20.47,4.9 R2.2
  Top 0.267: 4.04,14.78 4.14,14.91 5,16.33
  Top 0.279: 3.91,14.68 4.04,14.78
  Top 0.305: U$2.P$4 24.05,4.17 22.33,4.17 R2.2
  Top 0.356: 5,16.33 5.71,17.07 IC$4.15 | 25.38,2.69 24.41,1.68 24.36,0.79 24.16,0.43 2.46,0.43 2.36,1.12 1.96,2.62 0.71,2.92 0.71,6.93 2.74,8.74 | 3.45,14.22 3.91,14.68
  Top 0.381: 25.38,4.47 25.38,2.69 | 2.74,8.74 2.74,12.19 3.45,14.22
  Top 0.406: U$2.P$4 25.38,4.47
N$1
  Top 0.406: J5.2 14.25,33.24 14.12,34.11 14.07,34.44 14.07,35.99 IC$8.P$6
N$2
  Top 0.305: 19.75,32.18 19.74,32.46 19.89,32.64 20.4,32.72
  Top 0.318: 19.75,30.95 19.75,32.18
  Top 0.406: 20.4,32.72 20.45,35.92 20.45,37.16 18.87,37.19 17.25,37.19 17.22,36.93 IC$10.P$6 | J7.2 14.53,31.95 14.83,31.8 16.46,31.43 17.8,30.96 19.75,30.95
N$3
  Top 0.335: U$4.P$1 14,29.19
  Top 0.406: 14,29.19 C20.2 14.86,29.16 R11.1
N$4
  Top 0.381: J1.1 24.08,24.77 24.33,24.98 24.56,25.21 IC$1.3
  Top 0.406: IC$1.1 23.39,24.49 J1.1
N$5
  Top 0.406: R18.1 11.06,8.4 10.92,8.25 11.05,8.36 IC$9.5
N$6
  Top 0.305: 6.12,31.6 U$5.P$1
  Top 0.406: C21.2 5,30.3 5.23,30.86 6.12,31.6
  Top 0.61: R12.1 C21.2
N$7
  Top 0.203: 5.33,24.31 IC$2.P$4
  Top 0.254: C11.2 5.71,23.75 5.71,23.98 5.33,24.31
N$9  (via drill 0.33)
  Top 0.279: 20.19,27.66 19.99,28.05 18.01,28.04 17.58,28.23 v17.68,28.25
  Top 0.305: C13.2 20.19,25.48 20.19,27.66 | v16.18,28.09 Y1.P$1
  Top 0.406: R9.1 Y1.P$1
  Bottom 0.305: v17.68,28.25 v16.18,28.09
N$10
  Top 0.61: L1.1 22.96,28.16 IC$1.5
N$12
  Bottom 0.406: IC$3.27 5.28,7.11 4.55,7.95 3.07,7.95 2.74,9.63 C16.2
N$13  (via drill 0.33)
  Top 0.406: v9.3,1.27 11.2,1.27 D6.C 13.34,1.27 D7.C
  Bottom 0.406: S$1.P$1 S$1.P$2 v9.3,1.27
N$14
  Top 0.406: U$1.P$1 16.69,4.14 18.39,4.14 19.23,4.39 C2.1
N$15
  Bottom 0.381: 22.53,4.19 22.81,4.44
  Bottom 0.406: 22.53,4.19 22.48,1.98 23.8,1.98 23.9,2.11 23.93,2.18 24.16,2.49 24.61,2.95 24.61,3.76 C7.2 | 22.81,4.44 IC$3.2
N$16
  Bottom 0.381: 24.11,1.43 21.89,1.43
  Bottom 0.406: C7.1 24.38,1.55 24.11,1.43 | 21.89,1.43 21.97,4.27 IC$3.3
N$17
  Top 0.305: C2.2 R3.2
N$18  (via drill 0.33)
  Top 0.305: U$2.P$3 22.17,4.7 21.54,5.1 R2.1 R3.1 22.1,7.29 22.1,8.53 v22.33,8.84 | v18.72,9.22 17.55,9.5 16.36,9.5 C1.1
  Bottom 0.305: v22.33,8.84 19.61,8.84 v18.72,9.22
N$19
  Bottom 0.406: IC$3.26 5.99,7.29 5.51,7.72 5.26,9.39 5.18,9.68 R13.2
N$20
  Top 0.406: R1.2 25.6,6.1 25.6,5.38 | 25.6,5.38 25.6,5.36 23.93,5.36 23.24,6.04 U$2.P$1 | J2.1 25.93,4.65 25.6,5.38
N$21
  Top 0.406: C5.2 R4.1 22.63,1.98 23.82,1.98 24.49,2.67 J2.2
N$24
  Bottom 0.305: 20.78,3.35 20.78,2.34 18.03,2.34 C8.1
  Bottom 0.356: 20.78,3.35 20.8,3.61 20.75,4.27
  Bottom 0.406: IC$3.5 20.75,4.27
N$27
  Bottom 0.305: C8.2 19.36,1.76
  Bottom 0.343: 21.36,1.77 19.36,1.76
  Bottom 0.356: IC$3.4 21.34,3.86 21.36,1.77
N$30
  Bottom 0.406: IC$3.28 4.62,6.63 4.32,7.29 2.18,7.29 C17.2
NRST  (via drill 0.33)
  Top 0.254: RST.TP v8.66,28.75 | v12.07,25.02 11.66,25.16
  Top 0.279: 11.41,25.07 11.38,25.16
  Top 0.292: 11.38,25.16 11.66,25.16
  Top 0.406: IC$4.4 11.41,25.07 | C15.1 9.42,30.61 RST.TP
  Bottom 0.254: v12.07,25.02 11.38,25.88 10.95,26.77 10.67,27.31 9.65,28.73 9.42,28.88 v8.66,28.75
OSC_IN  (via drill 0.33)
  Top 0.381: 13.89,24.97 C9.2 v15.37,24.84
  Top 0.406: 13.89,24.97 13.34,24.97 13.34,24.44 13.18,24.13 IC$4.2 | v17.55,26.21 Y1.P$2
  Bottom 0.406: v15.37,24.84 16.79,25.43 17.45,25.43 v17.55,26.21
OSC_OUT
  Top 0.305: IC$4.3 12.22,24.26 12.75,24.51 12.75,25.35 R9.2
PBI$1  (via drill 0.33)
  Top 0.254: IC$4.22 12.19,14.17 12.19,13.61 10.67,13.49 10.25,13.25 9.6,11.96 8.51,11.96 v8.15,11.99 7.47,11.73 6.65,10.69 6.65,9.86 D4.C | 12.13,3.76 D6.A
  Top 0.406: v8.13,9.58 8.15,9.32 8.28,8.87 9.68,5.49 9.67,3.76 | 9.67,3.76 12.13,3.76 | v8.97,3.73 9.67,3.76
  Bottom 0.406: v8.13,9.58 v8.15,11.99 | v8.97,3.73 S$3.P$1 S$3.P$2
PBI$2  (via drill 0.33)
  Top 0.216: 6.22,11.1 6.22,10.06 5.22,10.06 5.05,9.4
  Top 0.254: IC$4.19 9.8,14.12 9.8,13.69 9.45,12.88 8.46,12.62 | 8.46,12.62 7.47,12.62 6.22,11.1 | 19.1,2.24 19.1,2.34 | D5.C 8.46,12.62 | 5.05,9.4 5.03,8.74 4.45,8.25
  Top 0.305: v23.22,2.67 23.06,3.07 19.84,3.07 v19.28,3.02
  Top 0.406: 19.1,2.24 18.72,1.37 18.03,1.3 15.19,1.3 15.29,2.51 14.76,2.8 | 19.1,2.34 v19.28,3.02 | 14.76,2.8 14.4,3 13.74,2.44 13.31,2.21 11.66,3.05 8.05,3.05 7.87,3.07 7.24,3.25 3.48,3.99 1.55,5.21 1.55,6.71 3.3,8.25 4.45,8.25 | D7.A 14.76,2.8
  Bottom 0.178: v19.28,3.02 19.76,3.15 20.02,3.23 S$2.P$1
  Bottom 0.254: v23.22,2.67 S$2.P$2
PIEZONEG  (via drill 0.33)
  Top 0.305: IC$4.20 10.62,15.09 10.62,15.57 10.44,16.08 10.44,17.12 v9.63,17.78
  Top 0.381: IC$4.13 4.8,18.69 v4.78,18.42 4.27,18.11 2.72,18.11 2.56,17.32 2.56,13.87 ZN.P$1
  Bottom 0.305: v9.63,17.78 8.31,17.78 7.8,17.76 6.48,17.76 v4.78,18.42
  Bottom 0.381: R8.2 ZN.P$1
  Bottom 0.406: D1.P$2 ZN.P$1
PIEZOPOS  (via drill 0.33)
  Top 0.305: 11.38,15.6 11.41,15.47
  Top 0.381: IC$4.12 5.36,19.48 v4.78,19.46 | 4.67,19.53 4.6,19.63 4.04,20.42 2.9,20.42 2.39,20.19 ZP.P$1
  Top 0.406: v11.1,16.82 11.28,15.98 11.35,15.75 11.38,15.6 | 11.41,15.47 IC$4.21 | v4.78,19.46 4.67,19.53
  Bottom 0.381: R8.1 ZP.P$1
  Bottom 0.406: v4.78,19.46 6.81,18.49 8.08,18.44 9.58,18.47 10.21,18.46 v11.1,16.82
SCRPWR  (via drill 0.33)
  Top 0.254: IC$4.27 14.22,17.88 v13.82,16.94
  Bottom 0.254: Q1.P$2 18.75,12.04 17.6,12.04 17.2,11.91 16.99,12.17 16.99,12.98 16.84,13.21 15.65,13.21 13.34,15.7 13.34,16.79 v13.82,16.94
  Bottom 0.406: Q1.P$2 18.9,14.07 R10.1
SCRRES  (via drill 0.33)
  Top 0.406: v13.39,13 v11.23,12.9 | IC$4.18 v8.95,16.26
  Bottom 0.406: IC$3.14 14.4,9.1 v13.39,13 | v11.23,12.9 10.13,12.9 9.55,14.05 v8.95,16.26
SCRVREG  (via drill 0.33)
  Top 0.305: R1.1 23.47,6.98 v23.16,7.57
  Top 0.406: R1.1 U$2.P$5 | C10.2 U$1.P$4 17.84,6.22 v18.06,7.9
  Top 0.61: v16.99,10.59 v15.75,10.59
  Bottom 0.305: v23.16,7.57 22.96,7.19 19.98,7.15
  Bottom 0.381: 17.88,4.42 17.5,3.91 16.92,3.91 16.51,4.5
  Bottom 0.406: 20,5.62 IC$3.6 20.07,6.73 19.98,7.15 19.89,7.64 v18.06,7.9 17.86,6.98 17.83,5.33 IC$3.9 17.88,5.5 17.88,4.42 | 16.51,4.5 16.51,5.51 IC$3.11 16.54,6.68 | Q1.P$1 18.41,10.62
  Bottom 0.61: v18.06,7.9 16.94,8.81 15.72,9.91 v15.75,10.59 | 18.41,10.62 v16.99,10.59
SWDCLK/USBD+  (via drill 0.33)
  Top 0.279: 18.29,13.41 16.99,13.41
  Top 0.305: 13.82,14.04 IC$4.24 | 18.87,13.51 18.29,13.41 | 16.99,13.41 v16.33,13.82
  Top 0.406: U1.D+ 18.87,13.51 | v14.07,16.13 13.79,15.7 IC$4.24
  Bottom 0.305: v16.33,13.82 v14.07,16.13
SWDIO/USBD-  (via drill 0.33)
  Top 0.305: v12.05,16.94 12.42,16.46 12.78,16.08 12.98,15.82 12.98,14.06 IC$4.23 | v16.28,12.57 R5.2
  Top 0.406: U1.D- 19.13,12.85 R5.2
  Bottom 0.305: 16.21,12.67 v16.28,12.57 15.34,12.72 12.12,16.43 12.05,16.74 v12.05,16.94
VBAT
  Top 0.203: D2.P$2 20.88,21.77
  Top 0.254: 20.88,21.77 20.88,21.82
  Top 0.406: C28.1 10.36,11.58 11,12.17 13.54,12.17 13.79,11.99 13.79,10.62 IC$9.3
  Top 0.61: 13.54,12.17 14.58,12.29 14.58,15.06 14.63,15.39 16.03,15.39 16.54,15.6 16.54,18.29 17.17,18.29 17.75,18.9 18.03,19.61 18.06,20.27 18.09,20.7 19.84,21.67 20.88,21.82 | C28.1 9.04,11.18 8.2,11.18 7.26,10.08 7.26,9.47 7.37,8.84 7.49,8.66 U$3.P$2
VCC  (via drill 0.33)
  Top 0.356: J1.2 25.95,24.49
  Top 0.381: 25.95,24.49 25.95,29.39 25.4,30.18 24.97,30.17 24.62,30.16
  Top 0.406: C25.2 25.17,30.9 24.97,30.17 | 23.53,30.19 24.62,30.16 23.77,30.18 22.15,30.2 | 22.15,30.2 22.28,30.3 22.28,30.92 | 22.28,30.92 22.28,31.2 IC$6.1 22.28,30.92 | C4.2 22.15,27.86 22.15,30.2 | J1.2 25.86,23.17 25.86,21.06 25.25,20.88 23.85,20.88 23.44,21.06 23.42,21.21 23.42,21.46 23.06,22.15 23.06,22.94 22.58,23.1 D3.P$1 | D2.P$1 v20.88,23.95 20.88,24.03 | R16.1 v3.61,19.58
  Top 0.61: D2.P$1 D3.P$1
  Bottom 0.406: v20.88,23.95 20.85,23.6 20.83,22.78 7.01,22.78 5.92,20.14 3.89,20.14 v3.61,19.58
VREG  (via drill 0.33, 0.36)
  Top 0.178: v7.6,15.16 8.21,15.11
  Top 0.203: C6.2 3.98,25.52 IC$2.P$1 5.36,25.5
  Top 0.229: 7.71,22.86 7.68,24.71 IC$2.P$8 | 6.59,27.47 6.38,26.87 6.42,26.46 R6.1 | 6.2,27.46 R7.1
  Top 0.249: 3.34,27.51 4.23,27.46 6.2,27.46
  Top 0.254: 6.42,26.46 5.71,25.6 | 5.71,25.6 5.71,24.74 5.69,24.71 IC$2.P$8 | 5.71,25.6 5.56,25.4 5.36,25.5 | C12.1 3.34,27.51 | 6.2,27.46 6.59,27.47 | 8.21,15.54 8.33,15.75 8.36,15.98 8.36,16.74 8.66,16.99 8.84,17.04 | 7.71,22.86 8.03,22.58 8.41,21.77 9.88,21.79 11.05,21.77
  Top 0.292: 20.83,26.98 23.42,26.98
  Top 0.305: IC$4.17 8.21,15.11 8.21,15.54 | 13.82,23.69 IC$4.1
  Top 0.356: 23.42,26.98 23.85,27.05 24.16,27.25 24.16,27.53 24.38,27.76 24.76,27.76 IC$1.4 | C3.1 24.74,23.24 24.74,24.36 24.77,24.68 25.39,25.06
  Top 0.381: 13.82,23.69 14.05,23.48 15.67,23.48 15.93,23.85 C14.2
  Top 0.406: 8.84,17.04 8.84,18.95 11.05,19.53 | 11.05,19.53 12.65,19.84 13.61,20.7 13.61,21.54 13.79,22.25 13.77,22.49 IC$4.1 | 11.05,19.53 11.05,21.77 | 16.42,24.42 C14.2 16.87,25.68 16.87,27.28 16.92,27.71 16.92,28.35 17.07,28.97 17.78,28.97 20.07,28.98 20.83,28.73 20.83,26.98 | C22.1 C24.1 6.37,12.34 6.71,12.6 7.01,12.83 7.01,13.74 7.57,14.33 IC$4.17 | 25.39,25.06 25.39,27.08 IC$1.4
  Top 0.61: L1.2 24.71,28.21 IC$1.4 | 25.12,22.27 C3.1 | v25.07,21.69 25.12,22.27 | 25.09,21.59 25.12,22.27
  Bottom 0.178: R15.2 v7.6,15.16
  Bottom 0.406: Q1.P$3 17.68,14.28 R10.2
  Bottom 0.533: 19.25,17.48 21.01,18.52
  Bottom 0.61: 19.25,17.48 19.24,16.15 17.4,16.15 R10.2 | 21.01,18.52 21.34,18.62 24.59,18.64 25.07,19.58 v25.07,21.69
VUSB
  Top 0.203: D3.P$2 21.92,21.79
  Top 0.295: 9.02,10.57 11.01,10.57
  Top 0.305: 9.02,10.57 8.94,9.68
  Top 0.406: C30.2 11.3,11.25 10.92,11.2 10.92,10.65 IC$9.4 11.01,10.57 | R5.1 17.3,14.59 | 15.39,11.89 16.74,11.89 17.45,12.04 18.8,12.04 18.97,12.19 U1.VBUS
  Top 0.584: 17.3,15.93 17.3,17.53 17.53,17.55
  Top 0.61: 8.94,9.68 8.97,9.04 10.29,6.1 13.36,6.1 14.86,7.16 14.86,11.38 15.39,11.89 15.39,14.59 17.3,14.59 17.3,15.93 | 21.92,21.74 21.92,21.79 22,21.72 21.95,20.88 20.14,20.88 18.85,20.22 18.82,19.48 18.54,18.56 17.53,17.55
WKUP  (via drill 0.33)
  Top 0.178: D5.A 6.33,13.75 v6.55,14.63 7.01,14.66 7.04,14.81 7.04,15.57 7.14,15.8 7.85,15.82 7.99,16.21 7.99,19.48 8.69,19.81 v10.29,20.17 | v11.74,20.55 11.76,21.92 11.18,22.3 10.01,22.33 9.8,22.71 IC$4.6
  Top 0.254: D4.A 4.06,9.42 4.65,9.93 4.67,9.96 4.89,10.29 4.89,12.52 5.16,12.98 D5.A
  Bottom 0.178: v10.29,20.17 v11.74,20.55 | R15.1 7.62,13.36 6.99,14.02 v6.55,14.63

### Text on the board
bNames: ZP | ZN
tDocu: No top layer components left of this line